# EAGLE schematic main (EAGLE 7.5.0)
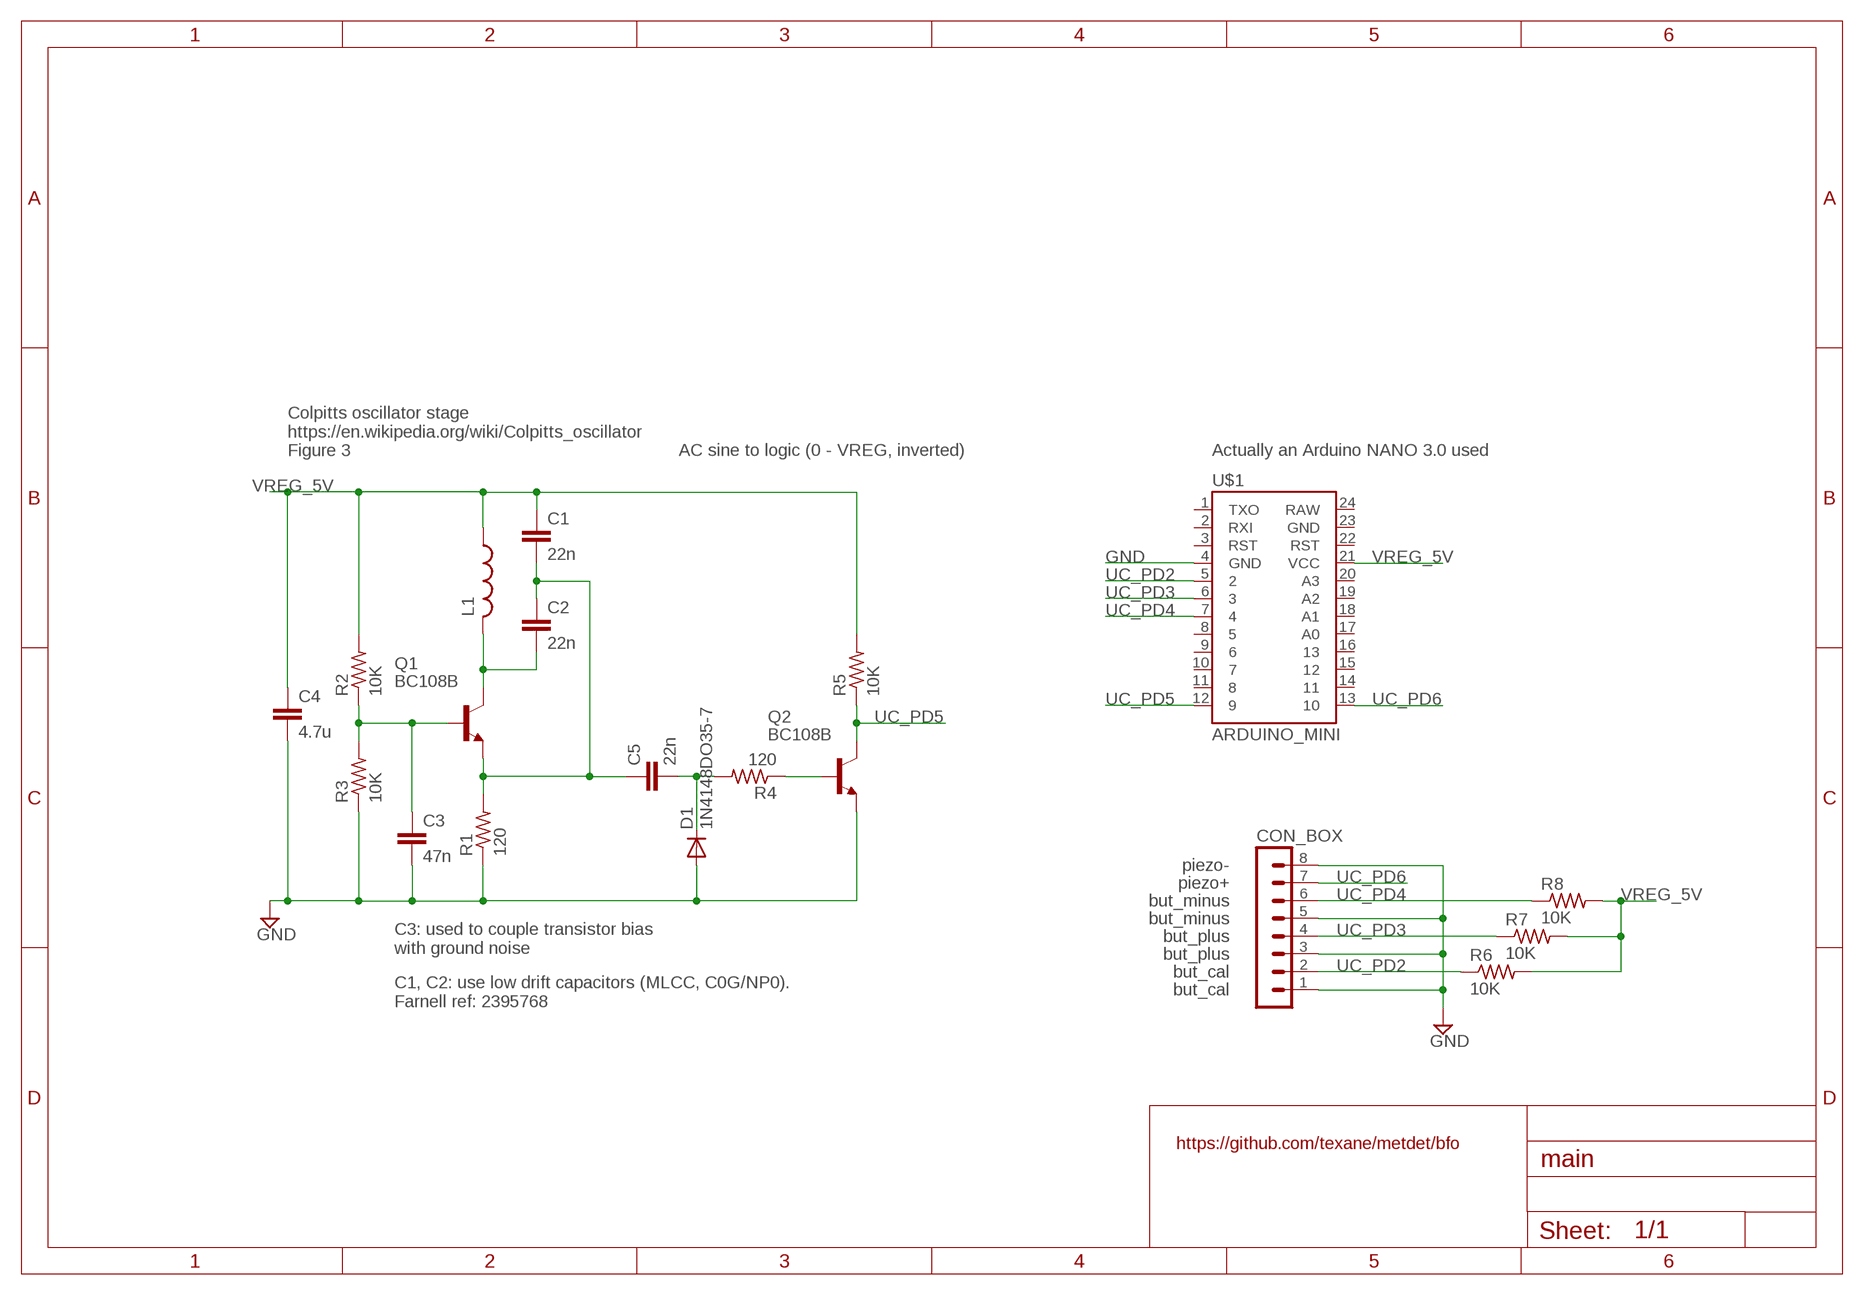
[diagram p0: schematic, sheet 1]

## Parts
C1  22n  C-EU025-024X044  [C025-024X044]
C2  22n  C-EU025-024X044  [C025-024X044]
C3  47n  C-EU025-024X044  [C025-024X044]
C4  4.7u  C-EU025-024X044  [C025-024X044]
C5  22n  C-EU025-024X044  [C025-024X044]
CON_BOX  MA08-1  [MA08-1]
D1  1N4148DO35-7  [DO35-7]
L1  L-US0204/5  [0204/5]
Q1  BC108B  [TO18]
Q2  BC108B  [TO18]
R1  120  R-US_0204/2V  [0204V]
R2  10K  R-US_0204/2V  [0204V]
R3  10K  R-US_0204/2V  [0204V]
R4  120  R-US_0204/2V  [0204V]
R5  10K  R-US_0204/2V  [0204V]
R6  10K  R-US_0204/2V  [0204V]
R7  10K  R-US_0204/2V  [0204V]
R8  10K  R-US_0204/2V  [0204V]
U$1  ARDUINO_MINI  [ARDUINO_MINI]

## Nets
GND: C3.2 C4.2 CON_BOX.1 CON_BOX.3 CON_BOX.5 CON_BOX.8 D1.A Q2.1(E) R1.1 R3.1 U$1.4(GND)
N$1: C3.1 Q1.2(B) R2.1 R3.2
N$3: C2.2 L1.2 Q1.3(C)
N$5: Q2.2(B) R4.1
N$6: C5.2 D1.C R4.2
N$10: C1.2 C2.1 C5.1 Q1.1(E) R1.2
UC_PD2: CON_BOX.2 R6.1 U$1.5
UC_PD3: CON_BOX.4 R7.1 U$1.6
UC_PD4: CON_BOX.6 R8.1 U$1.7
UC_PD5: Q2.3(C) R5.1 U$1.12
UC_PD6: CON_BOX.7 U$1.13
VREG_5V: C1.1 C4.1 L1.1 R2.2 R5.2 R6.2 R7.2 R8.2 U$1.21(VCC)
Unconnected: U$1.1(TXO) U$1.2(RXI) U$1.3(RST) U$1.8 U$1.9 U$1.10 U$1.11 U$1.14 U$1.15 U$1.16 U$1.17(A0) U$1.18(A1) U$1.19(A2) U$1.20(A3) U$1.22(RST) U$1.23(GND) U$1.24(RAW)

## Notes on the sheet
- Colpitts oscillator stage
  https://en.wikipedia.org/wiki/Colpitts_oscillator
  Figure 3
- AC sine to logic (0 - VREG, inverted) | Actually an Arduino NANO 3.0 used
- piezo-
- piezo+
- but_minus
- but_minus
- but_plus
- C3: used to couple transistor bias
  with ground noise
- but_plus
- but_cal
- but_cal
- C1, C2: use low drift capacitors (MLCC, C0G/NP0).
  Farnell ref: 2395768
- https://github.com/texane/metdet/bfo

## Library data of the parts
C1-C5 = rcl:C-EU: CAPACITOR, European symbol
CON_BOX = con-lstb:MA08-1: PIN HEADER; OC_FARNELL: unknown; OC_NEWARK: unknown
D1 = diode:1N4148: DIODE high speed (Philips)
L1 = rcl:L-US: INDUCTOR, American symbol
Q1 Q2 = transistor-npn:BC108B: NPN Transistor
R1-R8 = rcl:R-US_: RESISTOR, American symbol
U$1 = SparkFun-Boards:ARDUINO_MINI: Arduino Pro Mini footprint